# Altium project Sinc_Project.PrjPcb
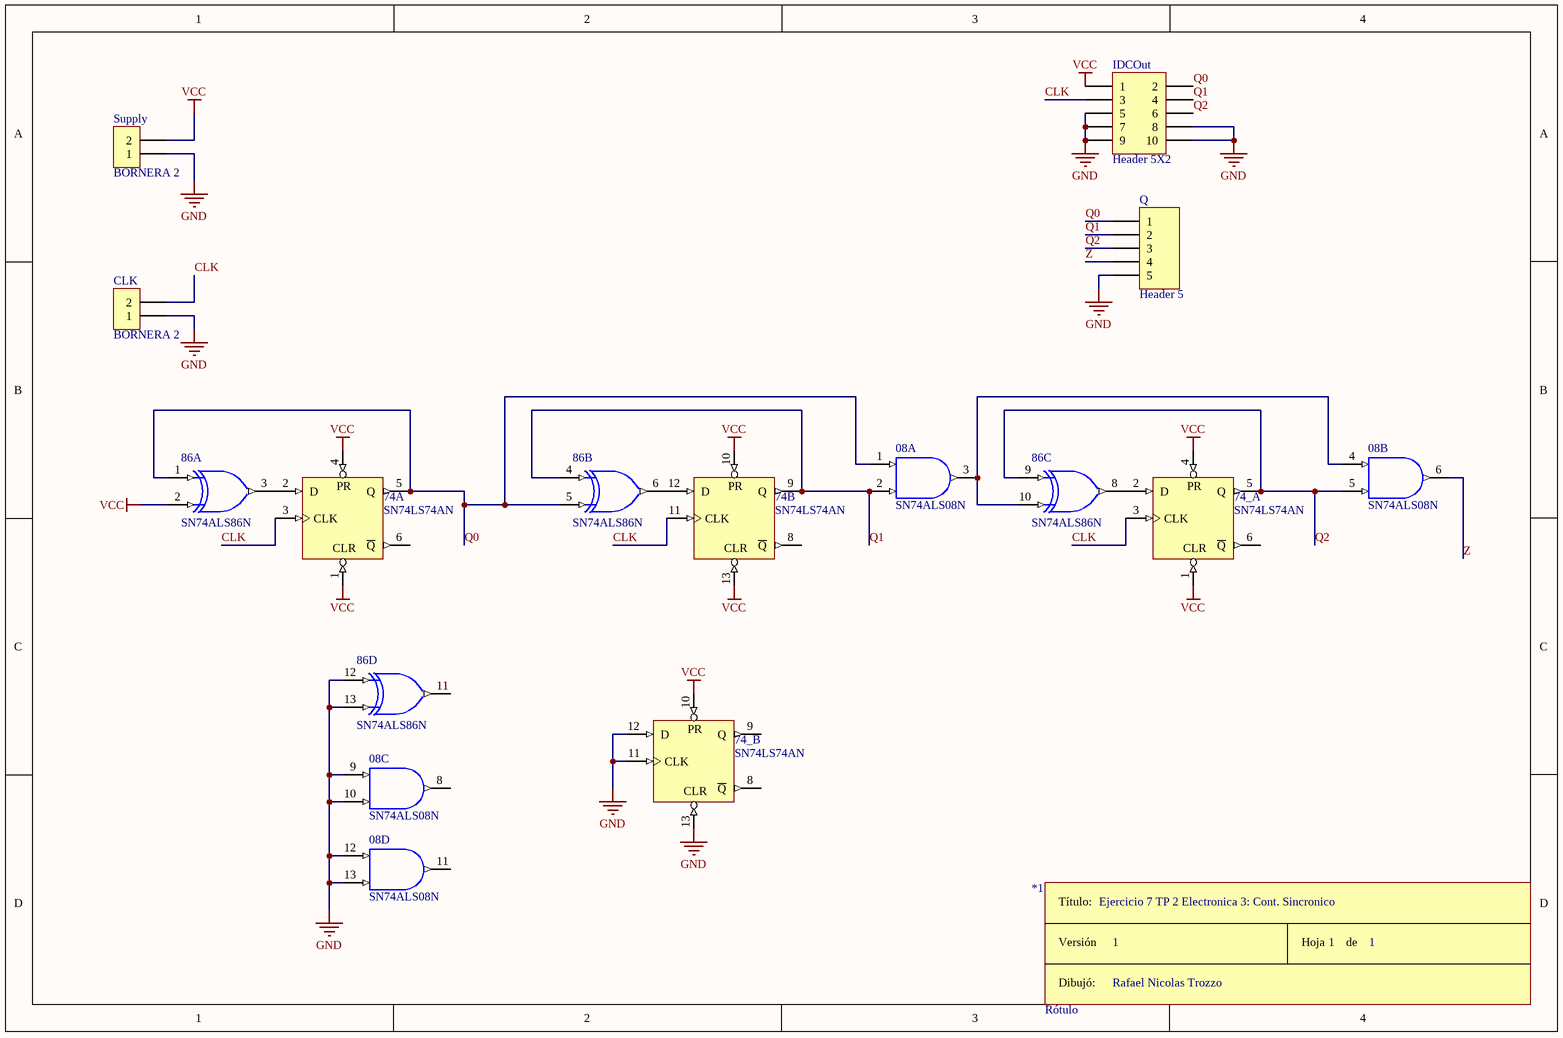
[diagram p0: sinc_counter.SchDoc]
1 sheet, 9 parts. Net scope: global (net labels, ports and power ports of the same name join across sheets).
Board file: sinc_counter.PcbDoc

## Sheet sinc_counter.SchDoc
size A4

### Parts
08  SN74ALS08N  [N014]  (parts A,B,C,D of 4)
74  SN74LS74AN  [N014D]  (parts A,B of 2)
74_  SN74LS74AN  [N014D]  (parts A,B of 2)
86  SN74ALS86N  [N014]  (parts A,B,C,D of 4)
*1  Rótulo
CLK  BORNERA 2  [BORNERA2]
IDCOut  Header 5X2  [HDR2X5]
Q  Header 5  [HDR1X5]
Supply  BORNERA 2  [BORNERA2]

### Nets
GND: 08.7(GND) 08.9(A) 08.10(B) 08.12(A) 08.13(B) 74.7(GND) 74_.7(GND) 74_.11(CLK) 74_.12(D) 74_.13(CLR) 86.7(GND) 86.12(A) 86.13(B) CLK.1 IDCOut.5 IDCOut.7 IDCOut.8 IDCOut.9 IDCOut.10 Q.5 Supply.1
VCC: 08.14(VCC) 74.1(CLR) 74.4(PR) 74.10(PR) 74.13(CLR) 74.14(VCC) 74_.1(CLR) 74_.4(PR) 74_.10(PR) 74_.14(VCC) 86.2(B) 86.14(VCC) IDCOut.1 Supply.2
CLK: 74.3(CLK) 74.11(CLK) 74_.3(CLK) CLK.2 IDCOut.3
Q0: 08.1(A) 74.5(Q) 86.1(A) 86.5(B) IDCOut.2 Q.1
Q1: 08.2(B) 74.9(Q) 86.4(A) IDCOut.4 Q.2
Q2: 08.5(B) 74_.5(Q) 86.9(A) IDCOut.6 Q.3
Z: 08.6(Y) Q.4
Net08_3: 08.3(Y) 08.4(A) 86.10(B)
Net74_2: 74.2(D) 86.3(Y)
Net74_12: 74.12(D) 86.6(Y)
Net74__2: 74_.2(D) 86.8(Y)

Not connected (* = marked no-connect by the designer): 08 8(Y) 11(Y); 74 6(~{Q}) 8(~{Q}); 74_ 6(~{Q}) 8(~{Q}) 9(Q); 86 11(Y)

### Notes on the sheet
- Ejercicio 7 TP 2 Electronica 3: Cont. Sincronico
- 1
- Rafael Nicolas Trozzo
- (in symbol Rótulo) Título:; Versión; Hoja       de; Dibujó:

### Library data of the parts
08 = SN74ALS08N: Quadruple 2-Input Positive-AND Gate; Published: 8-Jun-2000; LatestRevisionDate: 04-Mar-2005; LatestRevisionNote: Stylized 3D Model Added.; DatasheetVersion: Dec-1994; PackageVersion: Oct-1995; PackageReference: N014; Publisher: Altium Limited; PackageDescription: DIP; 14 Leads; Row Spacing 7.62 mm; Pitch 2.54 mm; ComponentLink1Description: Manufacturer Link; ComponentLink1URL: http://www.ti.com/; ComponentLink2Description: Datasheet; ComponentLink2URL: http://www-s.ti.com/sc/ds/sn74als08.pdf; ComponentLink3Description: Packaging Specification; ComponentLink3URL: http://focus.ti.com/lit/ml/mpdi002c/mpdi002c.pdf
74 74_ = SN74LS74AN: Dual D-Type Positive-Edge-Triggered Flip-Flop with Preset and Clear; Published: 8-Jun-2000; LatestRevisionDate: 04-Mar-2005; LatestRevisionNote: Stylized 3D Model Added.; DatasheetVersion: Mar-1988; PackageVersion: Oct-1995; PackageReference: N014D; Publisher: Altium Limited; PackageDescription: DIP; 14 Leads; Row Spacing 7.62 mm; Pitch 2.54 mm; ComponentLink1Description: Manufacturer Link; ComponentLink1URL: http://www.ti.com/; ComponentLink2Description: Datasheet; ComponentLink2URL: http://www-s.ti.com/sc/ds/sn74ls74a.pdf
86 = SN74ALS86N: Quadruple 2-Input Exclusive-OR Gate; Published: 8-Jun-2000; LatestRevisionDate: 04-Mar-2005; LatestRevisionNote: Stylized 3D Model Added.; DatasheetVersion: Dec-1994; PackageVersion: Oct-1995; PackageReference: N014; Publisher: Altium Limited; PackageDescription: DIP; 14 Leads; Row Spacing 7.62 mm; Pitch 2.54 mm; ComponentLink1Description: Manufacturer Link; ComponentLink1URL: http://www.ti.com/; ComponentLink2Description: Datasheet; ComponentLink2URL: http://www-s.ti.com/sc/ds/sn54als86.pdf; ComponentLink3Description: Packaging Specification; ComponentLink3URL: http://focus.ti.com/lit/ml/mpdi002c/mpdi002c.pdf
IDCOut = Header 5X2: Header, 5-Pin, Dual row; LatestRevisionDate: 17-Jul-2002; LatestRevisionNote: Re-released for DXP Platform.; Publisher: Altium Limited
Q = Header 5: Header, 5-Pin; LatestRevisionDate: 17-Jul-2002; LatestRevisionNote: Re-released for DXP Platform.; Publisher: Altium Limited